# Altium schematic sheet Ampli50g.SchDoc
size A3
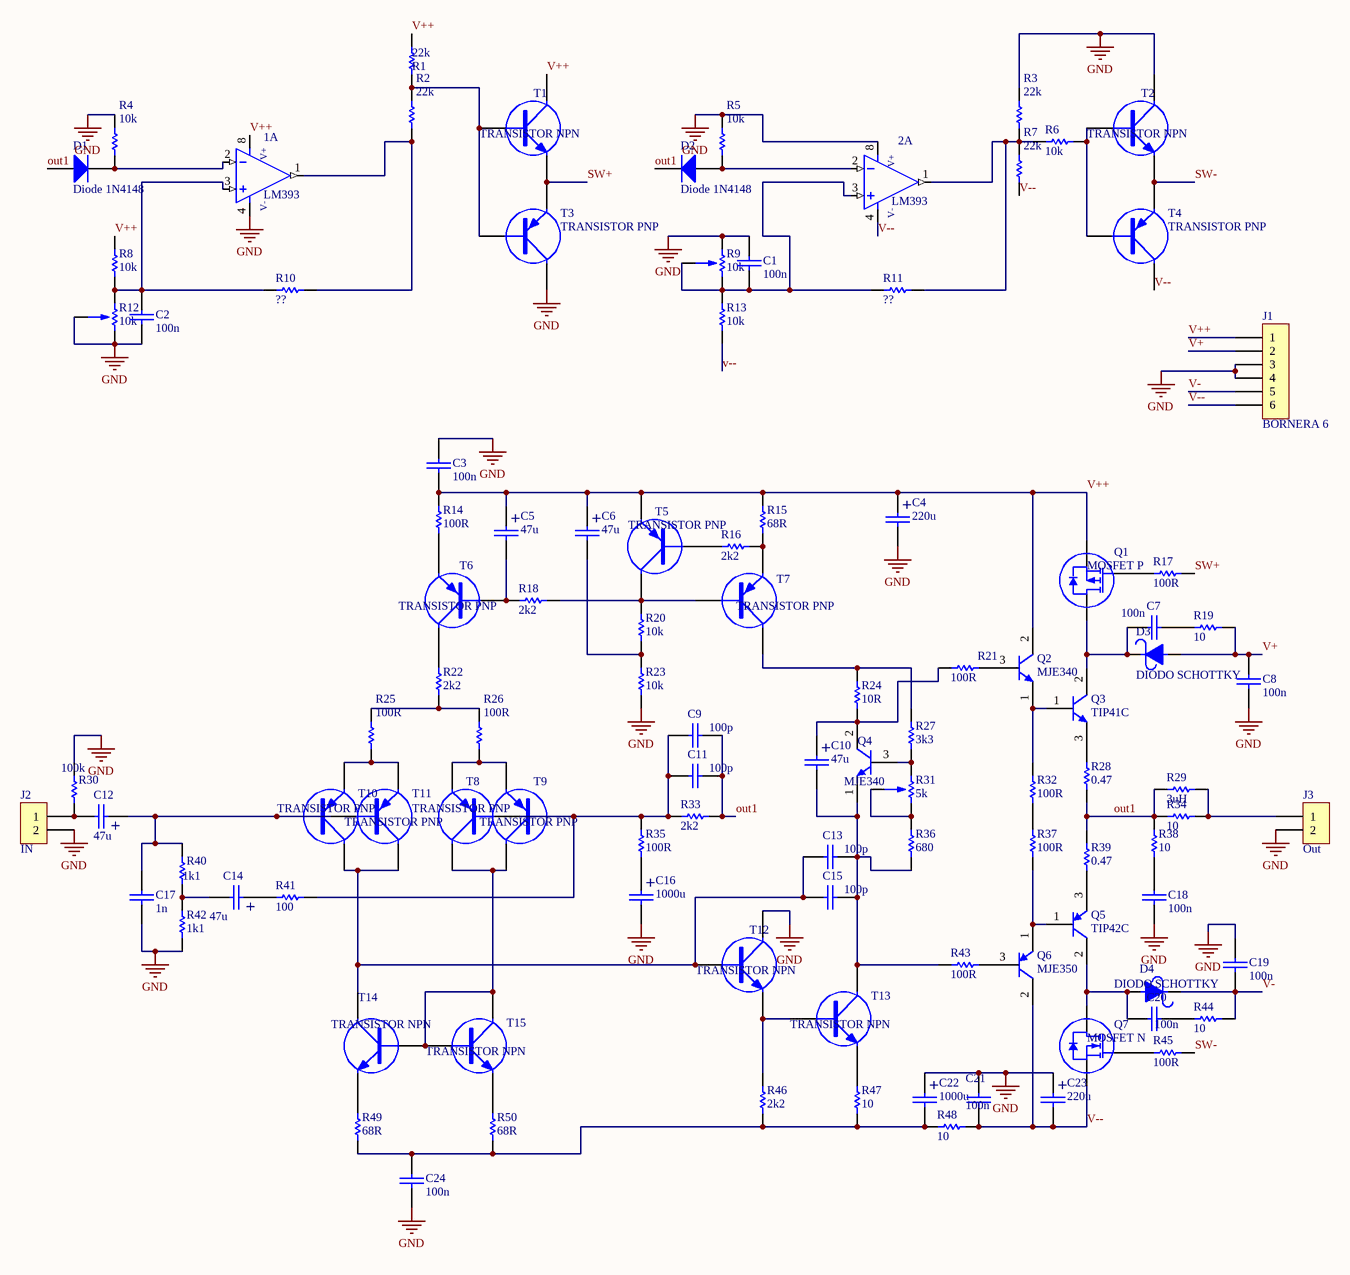
[diagram p0: Ampli50g.SchDoc]

## Parts
1  LM393  [SO08]  (part A of 2)
2  LM393  [SO08]  (part A of 2)
C1  100n  [1206]
C2  100n  [1206]
C3  100n  [CAP200]
C4  220u  [CAP200RP]
C5  47u  [CAP100RP]
C6  47u  [CAP100RP]
C7  100n  [CAP200]
C8  100n  [CAP200]
C9  100p  [1206]
C10  47u  [CAP100RP]
C11  100p  [1206]
C12  47u  [CAP100RP]
C13  100p  [1206]
C14  47u  [CAP100RP]
C15  100p  [1206]
C16  1000u  [CAP200RP]
C17  1n  [CAP200]
C18  100n  [CAP200]
C19  100n  [CAP200]
C20  100n  [CAP200]
C21  100n  [CAP200]
C22  1000u  [CAP200RP2]
C23  220u  [CAP200RP]
C24  100n  [CAP200]
D1  Diode 1N4148  [DO-35]
D2  Diode 1N4148  [DO-35]
D3  DIODO SCHOTTKY  [DO41]
D4  DIODO SCHOTTKY  [DO41]
J1  BORNERA 6  [BORNERA6]
J2  IN  [BORNERA2]
J3  Out  [BORNERA2]
Q1  MOSFET P  [TO-220 V]
Q2  MJE340  [ONSC-TO-225-3-77-09]
Q3  TIP41C  [ONSC-TO-220-3-221A-09]
Q4  MJE340  [ONSC-TO-225-3-77-09]
Q5  TIP42C  [ONSC-TO-220-3-221A-09]
Q6  MJE350  [ONSC-TO-225-3-77-09]
Q7  MOSFET N  [TO-220 V]
R1  22k  [1206]
R2  22k  [1206]
R3  22k  [1206]
R4  10k  [1206]
R5  10k  [1206]
R6  10k  [1206]
R7  22k  [1206]
R8  10k  [1206]
R9  10k  [PRESET V]
R10  ??  [1206]
R11  ??  [1206]
R12  10k  [PRESET V]
R13  10k  [1206]
R14  100R  [1206]
R15  68R  [1206]
R16  2k2  [1206]
R17  100R  [1206]
R18  2k2  [1206]
R19  10  [1206]
R20  10k  [1206]
R21  100R  [1206]
R22  2k2  [1206]
R23  10k  [1206]
R24  10R  [1206]
R25  100R  [1206]
R26  100R  [1206]
R27  3k3  [1206]
R28  0.47  [RES1200]
R29  3uH  [RES600]
R30  100k  [RES400]
R31  5k  [PRESET V]
R32  100R  [RES500]
R33  2k2  [1206]
R34  10  [RES600]
R35  100R  [1206]
R36  680  [1206]
R37  100R  [RES500]
R38  10  [RES600]
R39  0.47  [RES1200]
R40  1k1  [1206]
R41  100  [1206]
R42  1k1  [1206]
R43  100R  [1206]
R44  10  [1206]
R45  100R  [1206]
R46  2k2  [1206]
R47  10  [1206]
R48  10  [RES500]
R49  68R  [1206]
R50  68R  [1206]
T1  TRANSISTOR NPN  [SOT23]
T2  TRANSISTOR NPN  [SOT23]
T3  TRANSISTOR PNP  [SOT23]
T4  TRANSISTOR PNP  [SOT23]
T5  TRANSISTOR PNP  [SOT23]
T6  TRANSISTOR PNP  [SOT23]
T7  TRANSISTOR PNP  [SOT23]
T8  TRANSISTOR PNP  [SOT23]
T9  TRANSISTOR PNP  [SOT23]
T10  TRANSISTOR PNP  [SOT23]
T11  TRANSISTOR PNP  [SOT23]
T12  TRANSISTOR NPN  [SOT23]
T13  TRANSISTOR NPN  [SOT23]
T14  TRANSISTOR NPN  [SOT23]
T15  TRANSISTOR NPN  [SOT23]

## Nets
GND: 1.4(V-) 2.8(V+) C1.2 C2.1 C3.1 C4.2 C8.2 C16.2 C17.2 C18.2 C19.1 C21.1 C22.1 C23.1 C24.2 J1.3 J1.4 J2.2 J3.2 R3.2 R4.2 R5.2 R9.3 R12.1 R12.2 R23.2 R30.2 R42.1 T2.2(C) T3.2(C) T12.2(C)
out1: C9.2 C11.2 D1.1(A) D2.2(K) R28.1 R29.2 R33.1 R34.2 R38.2 R39.2
SW+: R17.1 T1.3(E) T3.3(E)
SW-: R45.1 T2.3(E) T4.3(E)
V+: C8.1 D3.1 J1.2 R19.2
V++: 1.8(V+) C3.2 C4.1 C5.1 C6.1 J1.1 Q1.3(S) Q2.2(C) R1.2 R8.2 R14.2 R15.2 T1.2(C) T5.3(E)
V-: C19.2 D4.2 J1.5 R44.2
V--: 2.4(V-) C21.2 C23.2 J1.6 Q6.2(C) Q7.3(S) R7.1 R13.1 R48.1 T4.2(C)
Net1_1: 1.1(OUT) R2.1 R10.1
Net1_2: 1.2(-IN) D1.2(K) R4.1
Net1_3: 1.3(+IN) C2.2 R8.1 R10.2 R12.3
Net2_1: 2.1(OUT) R3.1 R6.2 R7.2 R11.1
Net2_2: 2.2(-IN) D2.1(A) R5.1
Net2_3: 2.3(+IN) C1.1 R9.1 R9.2 R11.2 R13.2
NetC5_2: C5.2 R18.2 T6.1(B)
NetC6_2: C6.2 R20.2 R23.1
NetC7_1: C7.1 D3.2 Q1.2(D) Q3.2(C)
NetC7_2: C7.2 R19.1
NetC9_1: C9.1 C11.1 R33.2 R35.2 R41.1 T8.1(B) T9.1(B)
NetC10_1: C10.1 Q4.2(C) R21.2 R24.1
NetC10_2: C10.2 C13.2 C15.2 Q4.1(E) R36.1 R43.2 T13.2(C)
NetC12_1: C12.1 C17.1 R40.2 T10.1(B) T11.1(B)
NetC12_2: C12.2 J2.1 R30.1
NetC13_1: C13.1 C15.1 T10.2(C) T11.2(C) T12.1(B) T14.2(C)
NetC14_1: C14.1 R41.2
NetC14_2: C14.2 R40.1 R42.2
NetC16_1: C16.1 R35.1
NetC18_1: C18.1 R38.1
NetC20_1: C20.1 D4.1 Q5.2(C) Q7.2(D)
NetC20_2: C20.2 R44.1
NetC22_2: C22.2 C24.1 R46.2 R47.2 R48.2 R49.1 R50.1
NetJ3_1: J3.1 R29.1 R34.1
NetQ1_1: Q1.1(G) R17.2
NetQ2_1: Q2.1(E) Q3.1(B) R32.2
NetQ2_3: Q2.3(B) R21.1
NetQ3_3: Q3.3(E) R28.2
NetQ4_3: Q4.3(B) R27.1 R31.3
NetQ5_1: Q5.1(B) Q6.1(E) R37.1
NetQ5_3: Q5.3(E) R39.1
NetQ6_3: Q6.3(B) R43.1
NetQ7_1: Q7.1(G) R45.2
NetR1_1: R1.1 R2.2 T1.1(B) T3.1(B)
NetR6_1: R6.1 T2.1(B) T4.1(B)
NetR14_1: R14.1 T6.3(E)
NetR15_1: R15.1 R16.1 T7.3(E)
NetR16_2: R16.2 T5.1(B)
NetR18_1: R18.1 R20.1 T5.2(C) T7.1(B)
NetR22_1: R22.1 T6.2(C)
NetR22_2: R22.2 R25.2 R26.2
NetR24_2: R24.2 R27.2 T7.2(C)
NetR25_1: R25.1 T10.3(E) T11.3(E)
NetR26_1: R26.1 T8.3(E) T9.3(E)
NetR31_1: R31.1 R31.2 R36.2
NetR32_1: R32.1 R37.2
NetR46_1: R46.1 T12.3(E) T13.1(B)
NetR47_1: R47.1 T13.3(E)
NetR49_2: R49.2 T14.3(E)
NetR50_2: R50.2 T15.3(E)
NetT8_2: T8.2(C) T9.2(C) T14.1(B) T15.1(B) T15.2(C)

## Notes on the sheet
- (in symbol CAPPOL) +

## Library data of the parts
1 2 = LM393: Comparator Dual DIE; MF: Texas Instruments; Price: None; MP: LM393; Package: None; SnapEDA_Link: https://www.snapeda.com/parts/LM393/Texas%20Instruments/view-part/?ref=snap; Availability: Unavailable; Value: *
C1-C3 C7-C9 C11 C13 C15 C17-C21 C24 = CAP
C4-C6 C10 C12 C14 C16 C22 C23 = CAPPOL
D1 D2 = Diode 1N4148: High Conductance Fast Diode; Published: 8-Jun-2000; LatestRevisionDate: 17-Jul-2002; LatestRevisionNote: Re-released for DXP Platform.; DatasheetVersion: 1997; PackageReference: DO-35; Publisher: Altium Limited; PackageDescription: Diode, Axial; Body 3.8 x 1.9 mm (LxDia. max), Lead Dia. 0.53 mm (max); Code_JEDEC: DO-204-AH; ComponentLink1Description: Manufacturer Link; ComponentLink1URL: http://www.fairchildsemi.com/; ComponentLink2Description: Datasheet; ComponentLink2URL: http://www.fairchildsemi.com/ds/1N%2F1N4148.pdf
J2 J3 = BORNERA 2
Q2 Q4 = MJE340: Plastic Medium-Power NPN Silicon Transistor, 3-Pin TO-225, Bulk Box; Manufacturer: On Semiconductor; Note: 0; IC Continuous (A): 0.5; DatasheetVersion: Rev. 12; PackageVersion: Rev. AC, 12/2013; PackageReference: TO-225-3-77-09; PackageDescription: 3-Pin Flange Mount, Vertical Straight Lead, Body 7.6 x 2.7 mm, Pitch 2.29 mm; Packing: Bulk Box; Polarity: NPN; RoHS: FALSE; Mounting Technology: Through Hole; PartNumber: MJE340; ComponentLink1Description: Manufacturer URL; ComponentLink1URL: http://www.onsemi.com/; ComponentLink2Description: Datasheet; ComponentLink2URL: http://www.onsemi.com/pub_link/Collateral/MJE340-D.PDF; ComponentLink3Description: Package Specification; ComponentLink3URL: http://www.onsemi.com/pub_link/Collateral/77-09.PDF
Q3 = TIP41C: Complementary Silicon Plastic Power Transistor, 3-Pin TO-220, Tube; Manufacturer: On Semiconductor; fT Min (MHz): 3; IC Continuous (A): 6; Polarity: NPN; DatasheetVersion: Rev. 10; PackageVersion: Rev. AG, 09/2011; PackageReference: TO-220-3-221A-09; PackageDescription: 3-Pin Flange Mount, Vertical Straight Lead, Body 9.97 x 4.445 mm, Pitch 2.54 mm; Supplier 1: Digi-Key; Supplier Part Number 1: TIP41COS-ND; Packing: Tube; RoHS: FALSE; Mounting Technology: Through Hole; PartNumber: TIP41C; ComponentLink1Description: Manufacturer URL; ComponentLink1URL: http://www.onsemi.com/; ComponentLink2Description: Datasheet; ComponentLink2URL: http://www.onsemi.com/pub_link/Collateral/TIP41A-D.PDF; ComponentLink3Description: Package Specification; ComponentLink3URL: http://www.onsemi.com/pub_link/Collateral/221A-09.PDF
Q5 = TIP42C: Complementary Silicon Plastic Power Transistor, 3-Pin TO-220, Tube; Manufacturer: On Semiconductor; fT Min (MHz): 3; IC Continuous (A): 6; Polarity: PNP; DatasheetVersion: Rev. 10; PackageVersion: Rev. AG, 09/2011; PackageReference: TO-220-3-221A-09; PackageDescription: 3-Pin Flange Mount, Vertical Straight Lead, Body 9.97 x 4.445 mm, Pitch 2.54 mm; Supplier 1: Digi-Key; Supplier Part Number 1: TIP42COS-ND; Packing: Tube; RoHS: FALSE; Mounting Technology: Through Hole; PartNumber: TIP42C; ComponentLink1Description: Manufacturer URL; ComponentLink1URL: http://www.onsemi.com/; ComponentLink2Description: Datasheet; ComponentLink2URL: http://www.onsemi.com/pub_link/Collateral/TIP41A-D.PDF; ComponentLink3Description: Package Specification; ComponentLink3URL: http://www.onsemi.com/pub_link/Collateral/221A-09.PDF
Q6 = MJE350: Plastic Medium-Power PNP Silicon Transistor, 3-Pin TO-225, Bulk Box; Manufacturer: On Semiconductor; Note: 0; IC Continuous (A): 0.5; DatasheetVersion: Rev. 16; PackageVersion: Rev. AC, 12/2013; PackageReference: TO-225-3-77-09; PackageDescription: 3-Pin Flange Mount, Vertical Straight Lead, Body 7.6 x 2.7 mm, Pitch 2.29 mm; Packing: Bulk Box; Polarity: PNP; RoHS: FALSE; Mounting Technology: Through Hole; PartNumber: MJE350; ComponentLink1Description: Manufacturer URL; ComponentLink1URL: http://www.onsemi.com/; ComponentLink2Description: Datasheet; ComponentLink2URL: http://www.onsemi.com/pub_link/Collateral/MJE350-D.PDF; ComponentLink3Description: Package Specification; ComponentLink3URL: http://www.onsemi.com/pub_link/Collateral/77-09.PDF
R1-R3 R6 R7 R10 R11 R26 = RES: RES SMD 1/2W 1206
R4 R5 R8 R13-R25 R27-R30 R32-R50 = RES
R9 R12 R31 = PRESET